# Altium schematic sheet Amplificador.V03.R00.SchDoc: Etapa de Amplificación
size A4; SheetNumber: 8; SheetTotal: 18
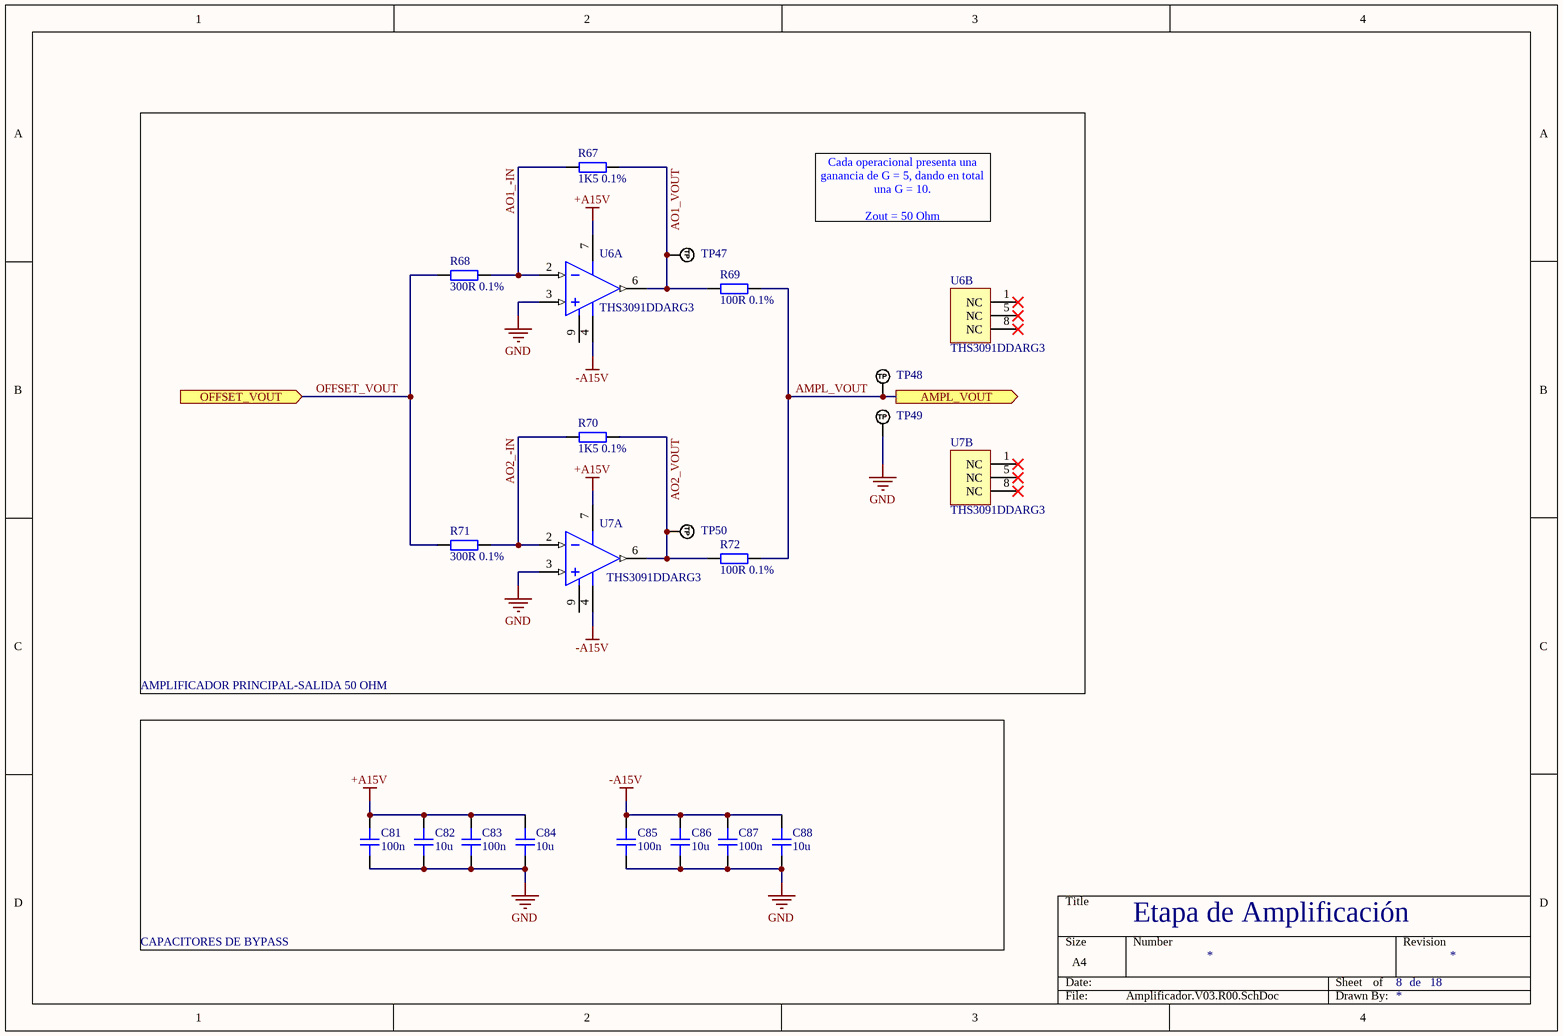
[diagram p0: Amplificador.V03.R00.SchDoc]

## Parts
C81  100n  [CAP_0805]
C82  10u  [CAP_0805]
C83  100n  [CAP_0805]
C84  10u  [CAP_0805]
C85  100n  [CAP_0805]
C86  10u  [CAP_0805]
C87  100n  [CAP_0805]
C88  10u  [CAP_0805]
R67  1K5 0.1%  [RES_0805]
R68  300R 0.1%  [RES_0805]
R69  100R 0.1%  [RES_0805]
R70  1K5 0.1%  [RES_0805]
R71  300R 0.1%  [RES_0805]
R72  100R 0.1%  [RES_0805]
TP47  TP_NOBOM  [PAD_RND_1MM]  (value not drawn)  (no BOM)
TP48  TP_NOBOM  [PAD_RND_1MM]  (value not drawn)  (no BOM)
TP49  TP_NOBOM  [PAD_RND_1MM]  (value not drawn)  (no BOM)
TP50  TP_NOBOM  [PAD_RND_1MM]  (value not drawn)  (no BOM)
U6  THS3091DDARG3  [TI-DDA8-1775X1775TP_M]  (parts A,B of 2)
U7  THS3091DDARG3  [TI-DDA8-1775X1775TP_M]  (parts A,B of 2)

## Blocks framed on the sheet
AMPLIFICADOR PRINCIPAL-SALIDA 50 OHM: R67-R72 TP47-TP50 U6 U7
CAPACITORES DE BYPASS: C81-C88

## Ports
AMPL_VOUT (out), OFFSET_VOUT (in)

## Nets
+A15V: C81.1 C82.1 C83.1 C84.1 U6.7(VS+) U7.7(VS+)
-A15V: C85.1 C86.1 C87.1 C88.1 U6.4(VS-) U7.4(VS-)
GND: C81.2 C82.2 C83.2 C84.2 C85.2 C86.2 C87.2 C88.2 TP49.1(TP) U6.3(VIN+) U7.3(VIN+)
AMPL_VOUT: R69.2 R72.2 TP48.1(TP) ; port AMPL_VOUT
AO1_-IN: R67.1 R68.2 U6.2(VIN-)
AO1_VOUT: R67.2 R69.1 TP47.1(TP) U6.6(VOUT)
AO2_-IN: R70.1 R71.2 U7.2(VIN-)
AO2_VOUT: R70.2 R72.1 TP50.1(TP) U7.6(VOUT)
OFFSET_VOUT: R68.1 R71.1 ; port OFFSET_VOUT

Not connected (* = marked no-connect by the designer): U6 1(NC)* 5(NC)* 8(NC)* 9(EP); U7 1(NC)* 5(NC)* 8(NC)* 9(EP)

## Notes on the sheet
- Cada operacional presenta una ganancia de G = 5, dando en total una G = 10.
  Zout = 50 Ohm
- de

## Library data of the parts
C81-C88 = CAP_0805: Capacitor SMD 0805; Manufacturer: *; Manufacturer Part Number: *; Distributor Link: *; LCSC: *; Rating: *; Dielectric: *
R67-R72 = RES_0805: Resistor SMD 0805; Manufacturer: *; Manufacturer Part Number: *; Distributor Link: *; LCSC: *
TP47-TP50 = TEST_POINT_RND_1MM: Test Point Round 1mm (NO BOM)
U6 U7 = CMP-0018-00513-2: Single-High-Voltage, Low Distortion, Current-Feedback Operational Amplifier, 10 to 30 V, -40 to 85 degC, 8-pin SOP (DDA8), Green (RoHS & no Sb/Br); Manufacturer: Texas Instruments; Vn at Flatband(Typ)(nV/rtHz): 2; Vio(Max)(mV): 4; BW @ Acl(MHz): 235; 3rd Harmonic(dBc): 74; Iib(Max)(nA): 20000; Io(Typ)(mA): 250; Slew Rate(Typ)(V/us): 7300; @ MHz: 10; THD (Fc is 1 MHz)(Typ)(dB): -75; Diff Gain(%): 0.013; Vs(Max)(V): 30; Sub Family: High Output Current Amplifier (>=50mA), High Speed Amplifier (>=50MHz), High Supply Voltage Amplifier (>=30V); 2nd Harmonic(dBc): 66; Iq per channel(Max)(mA): 11; Diff Phase(deg): 0.02; Number of Channels: 1; Settling Time (0.1%)(Typ)(ns): 42; PartNumber: THS3091DDARG3; DatasheetVersion: SLOS423G; ComponentLink1Description: Manufacturer URL; Vs(Min)(V): 10; Code_JEDEC: MS-012; ComponentLink3Description: Package Specification; ComponentLink2Description: Datasheet; PackageReference: DDA8-1775X1775TP; ComponentLink1URL: http://www.ti.com/; PackageVersion: 4202561/F, 12/2011; PackageDescription: 8-Pin PowerPAD(TM) Plastic Small Outline, Body 4.9 x 3.9 mm, Pitch 1.27 mm; Mounting Technology: Surface Mount; ComponentLink3URL: http://www.ti.com/litv/pdf/mpds092e; Eco-Plan: Green (RoHS & no Sb/Br); Acl, min stable gain(V/V): 1; ComponentLink2URL: http://www.ti.com/general/docs/lit/getliterature.tsp?genericPartNumber=THS3091&fileType=pdf